# Altium project Enigma Rev B.PrjPCB (part 2 of 8)

## Sheet Snickerdoodle FPGA JB.SchDoc: Snickerdoodle JB
size Tabloid; ApprovedBy: NA; CompanyName: Cospan Design LLC; DrawnBy: Dave McCoy; Engineer: Dave McCoy; DocumentNumber: 5; Revision: A; SheetNumber: 5; SheetTotal: 20; Client: Public; Project: Enigma; ProjectPrettyName: Enigma
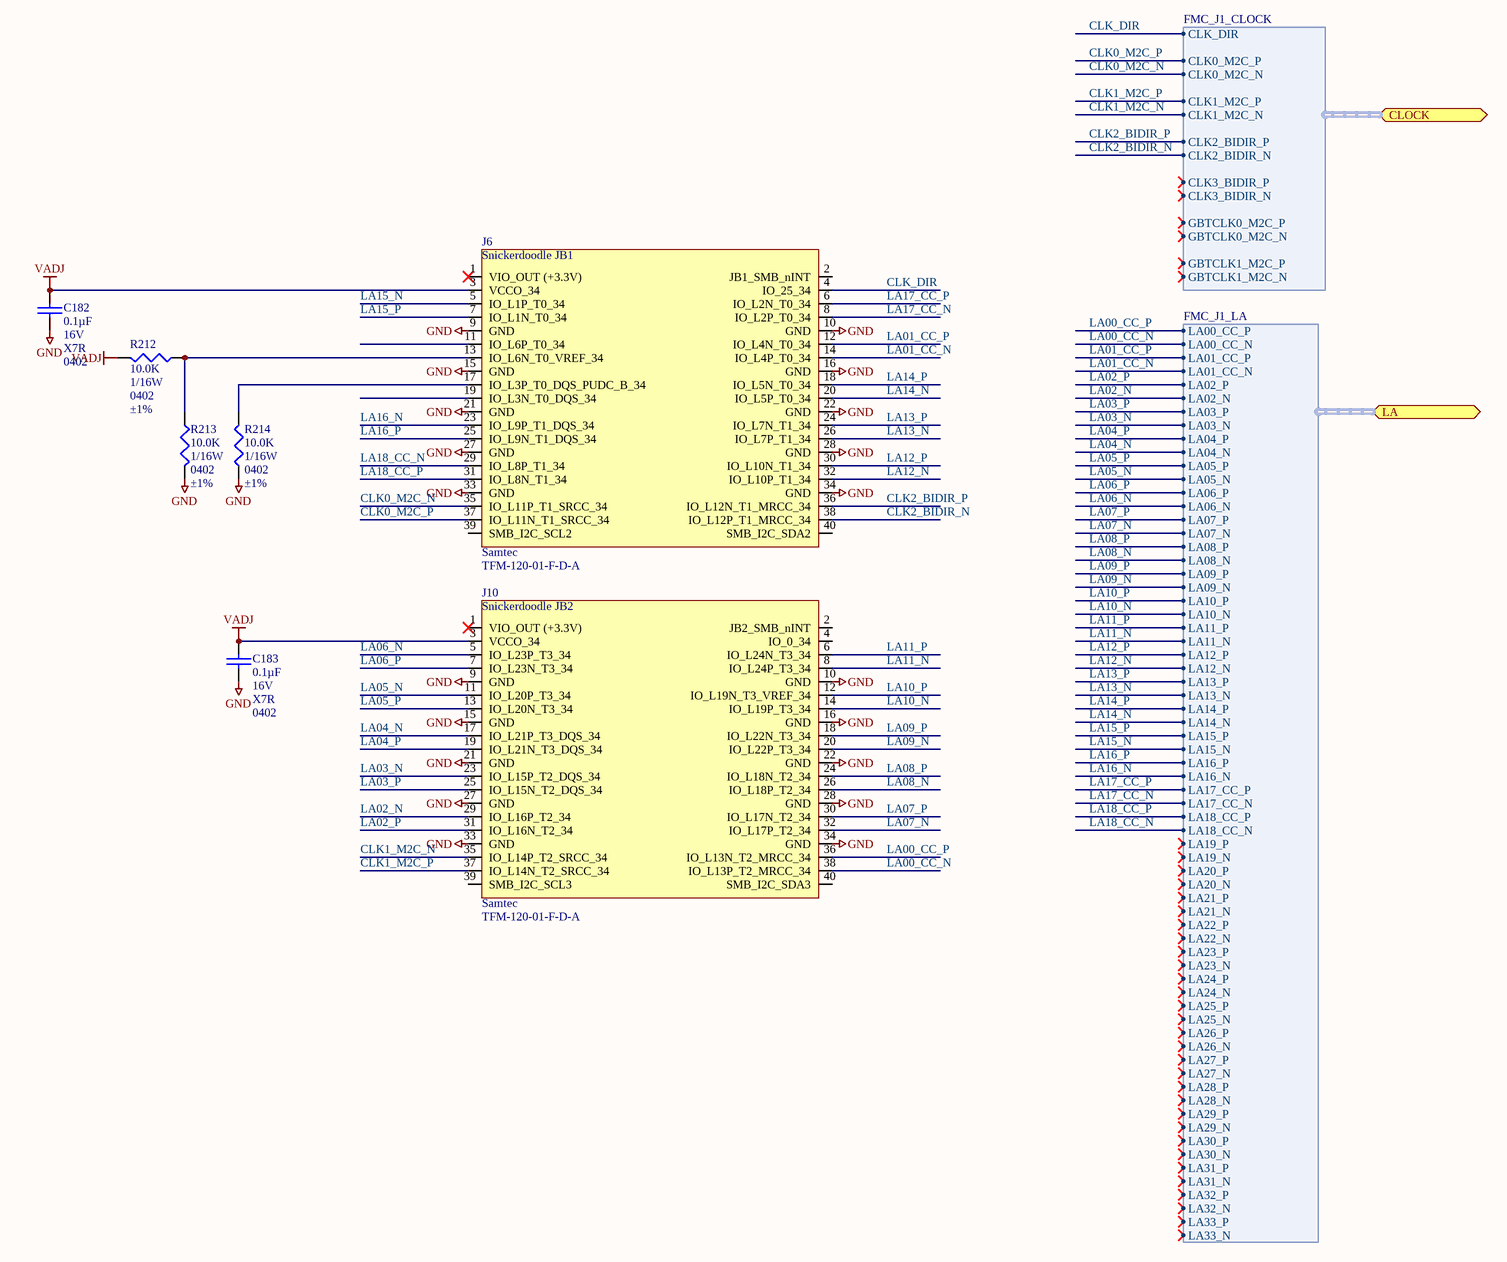
[diagram p5: Snickerdoodle FPGA JB.SchDoc]

### Parts
C182  Capacitance: 0.1µF  Voltage - Rated: 16V  Temperature Coefficient: X7R  Package / Case: 0402  [C_0402]  (hidden comment: 0.1uF)
C183  Capacitance: 0.1µF  Voltage - Rated: 16V  Temperature Coefficient: X7R  Package / Case: 0402  [C_0402]  (hidden comment: 0.1uF)
J6  Manufcaturer: Samtec  Manufacturer Part Number: TFM-120-01-F-D-A  [TFM12001-X-D-A]  (hidden comment: J_SNICKERDOODLE_JB1)
J10  Manufacturer: Samtec  Manufacturer Part Number: TFM-120-01-F-D-A  [TFM12001-X-D-A]  (hidden comment: J_SNICKERDOODLE_JB2)
R212  Resistance In Ohms: 10.0K  Power (Watts): 1/16W  Case: 0402  Tolerance: ±1%  [R_0402]  (hidden comment: R_0402_10.0K)
R213  Resistance In Ohms: 10.0K  Power (Watts): 1/16W  Case: 0402  Tolerance: ±1%  [R_0402]  (hidden comment: R_0402_10.0K)
R214  Resistance In Ohms: 10.0K  Power (Watts): 1/16W  Case: 0402  Tolerance: ±1%  [R_0402]  (hidden comment: R_0402_10.0K)

### Ports
CLOCK (harness FMC_J1_CLOCK), LA (harness FMC_J1_LA)

### Harnesses
FMC_J1_CLOCK: CLK_DIR, CLK0_M2C_N, CLK0_M2C_P, CLK1_M2C_N, CLK1_M2C_P, CLK2_BIDIR_N, CLK2_BIDIR_P, CLK3_BIDIR_N, CLK3_BIDIR_P, GBTCLK0_M2C_N, GBTCLK0_M2C_P, GBTCLK1_M2C_N, GBTCLK1_M2C_P
FMC_J1_LA: LA00_CC_N, LA00_CC_P, LA01_CC_N, LA01_CC_P, LA02_N, LA02_P, LA03_N, LA03_P, LA04_N, LA04_P, LA05_N, LA05_P, LA06_N, LA06_P, LA07_N, LA07_P, LA08_N, LA08_P, LA09_N, LA09_P, LA10_N, LA10_P, LA11_N, LA11_P, LA12_N, LA12_P, LA13_N, LA13_P, LA14_N, LA14_P, LA15_N, LA15_P, LA16_N, LA16_P, LA17_CC_N, LA17_CC_P, LA18_CC_N, LA18_CC_P, LA19_N, LA19_P, LA20_N, LA20_P, LA21_N, LA21_P, LA22_N, LA22_P, LA23_N, LA23_P, LA24_N, LA24_P, LA25_N, LA25_P, LA26_N, LA26_P, LA27_N, LA27_P, LA28_N, LA28_P, LA29_N, LA29_P, LA30_N, LA30_P, LA31_N, LA31_P, LA32_N, LA32_P, LA33_N, LA33_P

### Nets
GND: C182.1 C183.1 J6.9(GND) J6.10(GND) J6.15(GND) J6.16(GND) J6.21(GND) J6.22(GND) J6.27(GND) J6.28(GND) J6.33(GND) J6.34(GND) J10.9(GND) J10.10(GND) J10.15(GND) J10.16(GND) J10.21(GND) J10.22(GND) J10.27(GND) J10.28(GND) J10.33(GND) J10.34(GND) R213.1 R214.2
VADJ: C182.2 C183.2 J6.3(VCCO_34) J10.3(VCCO_34) R212.1
CLK0_M2C_N: J6.35(IO_L11P_T1_SRCC_34) ; port CLOCK.CLK0_M2C_N
CLK0_M2C_P: J6.37(IO_L11N_T1_SRCC_34) ; port CLOCK.CLK0_M2C_P
CLK1_M2C_N: J10.35(IO_L14P_T2_SRCC_34) ; port CLOCK.CLK1_M2C_N
CLK1_M2C_P: J10.37(IO_L14N_T2_SRCC_34) ; port CLOCK.CLK1_M2C_P
CLK2_BIDIR_N: J6.38(IO_L12P_T1_MRCC_34) ; port CLOCK.CLK2_BIDIR_N
CLK2_BIDIR_P: J6.36(IO_L12N_T1_MRCC_34) ; port CLOCK.CLK2_BIDIR_P
CLK_DIR: J6.4(IO_25_34) ; port CLOCK.CLK_DIR
LA00_CC_N: J10.38(IO_L13P_T2_MRCC_34) ; port LA.LA00_CC_N
LA00_CC_P: J10.36(IO_L13N_T2_MRCC_34) ; port LA.LA00_CC_P
LA01_CC_N: J6.14(IO_L4P_T0_34) ; port LA.LA01_CC_N
LA01_CC_P: J6.12(IO_L4N_T0_34) ; port LA.LA01_CC_P
LA02_N: J10.29(IO_L16P_T2_34) ; port LA.LA02_N
LA02_P: J10.31(IO_L16N_T2_34) ; port LA.LA02_P
LA03_N: J10.23(IO_L15P_T2_DQS_34) ; port LA.LA03_N
LA03_P: J10.25(IO_L15N_T2_DQS_34) ; port LA.LA03_P
LA04_N: J10.17(IO_L21P_T3_DQS_34) ; port LA.LA04_N
LA04_P: J10.19(IO_L21N_T3_DQS_34) ; port LA.LA04_P
LA05_N: J10.11(IO_L20P_T3_34) ; port LA.LA05_N
LA05_P: J10.13(IO_L20N_T3_34) ; port LA.LA05_P
LA06_N: J10.5(IO_L23P_T3_34) ; port LA.LA06_N
LA06_P: J10.7(IO_L23N_T3_34) ; port LA.LA06_P
LA07_N: J10.32(IO_L17P_T2_34) ; port LA.LA07_N
LA07_P: J10.30(IO_L17N_T2_34) ; port LA.LA07_P
LA08_N: J10.26(IO_L18P_T2_34) ; port LA.LA08_N
LA08_P: J10.24(IO_L18N_T2_34) ; port LA.LA08_P
LA09_N: J10.20(IO_L22P_T3_34) ; port LA.LA09_N
LA09_P: J10.18(IO_L22N_T3_34) ; port LA.LA09_P
LA10_N: J10.14(IO_L19P_T3_34) ; port LA.LA10_N
LA10_P: J10.12(IO_L19N_T3_VREF_34) ; port LA.LA10_P
LA11_N: J10.8(IO_L24P_T3_34) ; port LA.LA11_N
LA11_P: J10.6(IO_L24N_T3_34) ; port LA.LA11_P
LA12_N: J6.32(IO_L10P_T1_34) ; port LA.LA12_N
LA12_P: J6.30(IO_L10N_T1_34) ; port LA.LA12_P
LA13_N: J6.26(IO_L7P_T1_34) ; port LA.LA13_N
LA13_P: J6.24(IO_L7N_T1_34) ; port LA.LA13_P
LA14_N: J6.20(IO_L5P_T0_34) ; port LA.LA14_N
LA14_P: J6.18(IO_L5N_T0_34) ; port LA.LA14_P
LA15_N: J6.5(IO_L1P_T0_34) ; port LA.LA15_N
LA15_P: J6.7(IO_L1N_T0_34) ; port LA.LA15_P
LA16_N: J6.23(IO_L9P_T1_DQS_34) ; port LA.LA16_N
LA16_P: J6.25(IO_L9N_T1_DQS_34) ; port LA.LA16_P
LA17_CC_N: J6.8(IO_L2P_T0_34) ; port LA.LA17_CC_N
LA17_CC_P: J6.6(IO_L2N_T0_34) ; port LA.LA17_CC_P
LA18_CC_N: J6.29(IO_L8P_T1_34) ; port LA.LA18_CC_N
LA18_CC_P: J6.31(IO_L8N_T1_34) ; port LA.LA18_CC_P
NetJ6_13: J6.13(IO_L6N_T0_VREF_34) R212.2 R213.2
NetJ6_17: J6.17(IO_L3P_T0_DQS_PUDC_B_34) R214.1

Not connected (* = marked no-connect by the designer): J6 1(VIO_OUT_(+3.3V))* 2(JB1_SMB_nINT) 11(IO_L6P_T0_34) 19(IO_L3N_T0_DQS_34) 39(SMB_I2C_SCL2) 40(SMB_I2C_SDA2); J10 1(VIO_OUT_(+3.3V))* 2(JB2_SMB_nINT) 4(IO_0_34) 39(SMB_I2C_SCL3) 40(SMB_I2C_SDA3)

### Notes on the sheet
- Project:
- http://www.cospandesign.com
- Cospan Design
- Document:
- Engineer:
- Title:
- Client:
- Approved By:
- Revision:
- Date:
- Number:
- of
- (in symbol J_SNICKERDOODLE_JB1) Snickerdoodle JB1
- (in symbol J_SNICKERDOODLE_JB2) Snickerdoodle JB2

### Library data of the parts
C182 C183 = C_0402_0.1UF_16V: CAP CER .10UF 16V X7R 0402; Manufacturer: Murata Electronics North America; Manufacturer Part Number: GRM155R71C104KA88J; Tolerance: ±10%; Description: CAP CER 0.1UF 16V X7R 0402; Supplier 1: Digi-Key; RoHS: RoHS Compliant; Category: Capacitors; Stock 1: 18103134; Pricing 1: 1=0.1, 10=0.014, 100=0.0062, 500=0.00442, 1000=0.00348, 2500=0.00316, 5000=0.00291 (USD); Packaging: Cut Tape (CT); Part Status: Active; Operating Temperature: -55°C ~ 125°C; Features: -; Ratings: -; Applications: General Purpose; Mounting Type: Surface Mount, MLCC; Size / Dimension: 0.039" L x 0.020" W (1.00mm x 0.50mm); Height - Seated (Max): -; Thickness (Max): 0.022" (0.55mm); Lead Spacing: -; ComponentLink1URL: http://www.murata.com/~/media/webrenewal/support/library/catalog/products/capacitor/mlcc/c02e.ashx?la=en-us; ComponentLink1Description: http://www.murata.com/~/media/webrenewal/support/library/catalog/products/capacitor/mlcc/c02e.ashx?la=en-us; Supplier Part Number 1: 490-6328-1-ND
J6 = J_SNICKERDOODLE_JB1: SNICKERDOODLE JB1
J10 = J_SNICKERDOODLE_JB2: SNICKERDOODLE JB2
R212-R214 = R_0402_10.0K: RES 10.0K OHM 1/16W 1% 0402 SMD; Manufacturer: Stackpole Electronics Inc; Manufacturer Part Number: RMCF0402FT10K0; Resistance (Ohms): 10k; Temperature Coefficient: ±100ppm/°C; Supplier 1: Digi-Key; Supplier Part Number 1: RMCF0402FT10K0CT-ND; RoHS: RoHS Compliant; Category: Resistors; Stock 1: 234525; Pricing: 1=0.04, 10=0.025, 50=0.0138, 100=0.0105, 250=0.0078, 500=0.00576, 1000=0.00384, 2500=0.00324, 5000=0.0027 (USD); Composition: Thick Film; Features: -; Package / Case: 0402 (1005 Metric); Size / Dimension: 0.039" L x 0.020" W (1.00mm x 0.50mm); Height: 0.016" (0.40mm); Number of Terminations: 2; Packaging: Cut Tape (CT); ComponentLink1URL: http://www.seielect.com/Catalog/SEI-RMCF_RMCP.pdf; ComponentLink1Description: http://www.seielect.com/Catalog/SEI-RMCF_RMCP.pdf

## Sheet LCD.SchDoc: LCD
size Tabloid; ApprovedBy: NA; CompanyName: Cospan Design LLC; DrawnBy: Dave McCoy; Engineer: Dave McCoy; DocumentNumber: 12; Revision: A; SheetNumber: 12; SheetTotal: 20; Client: Public; Project: Enigma; ProjectPrettyName: Enigma
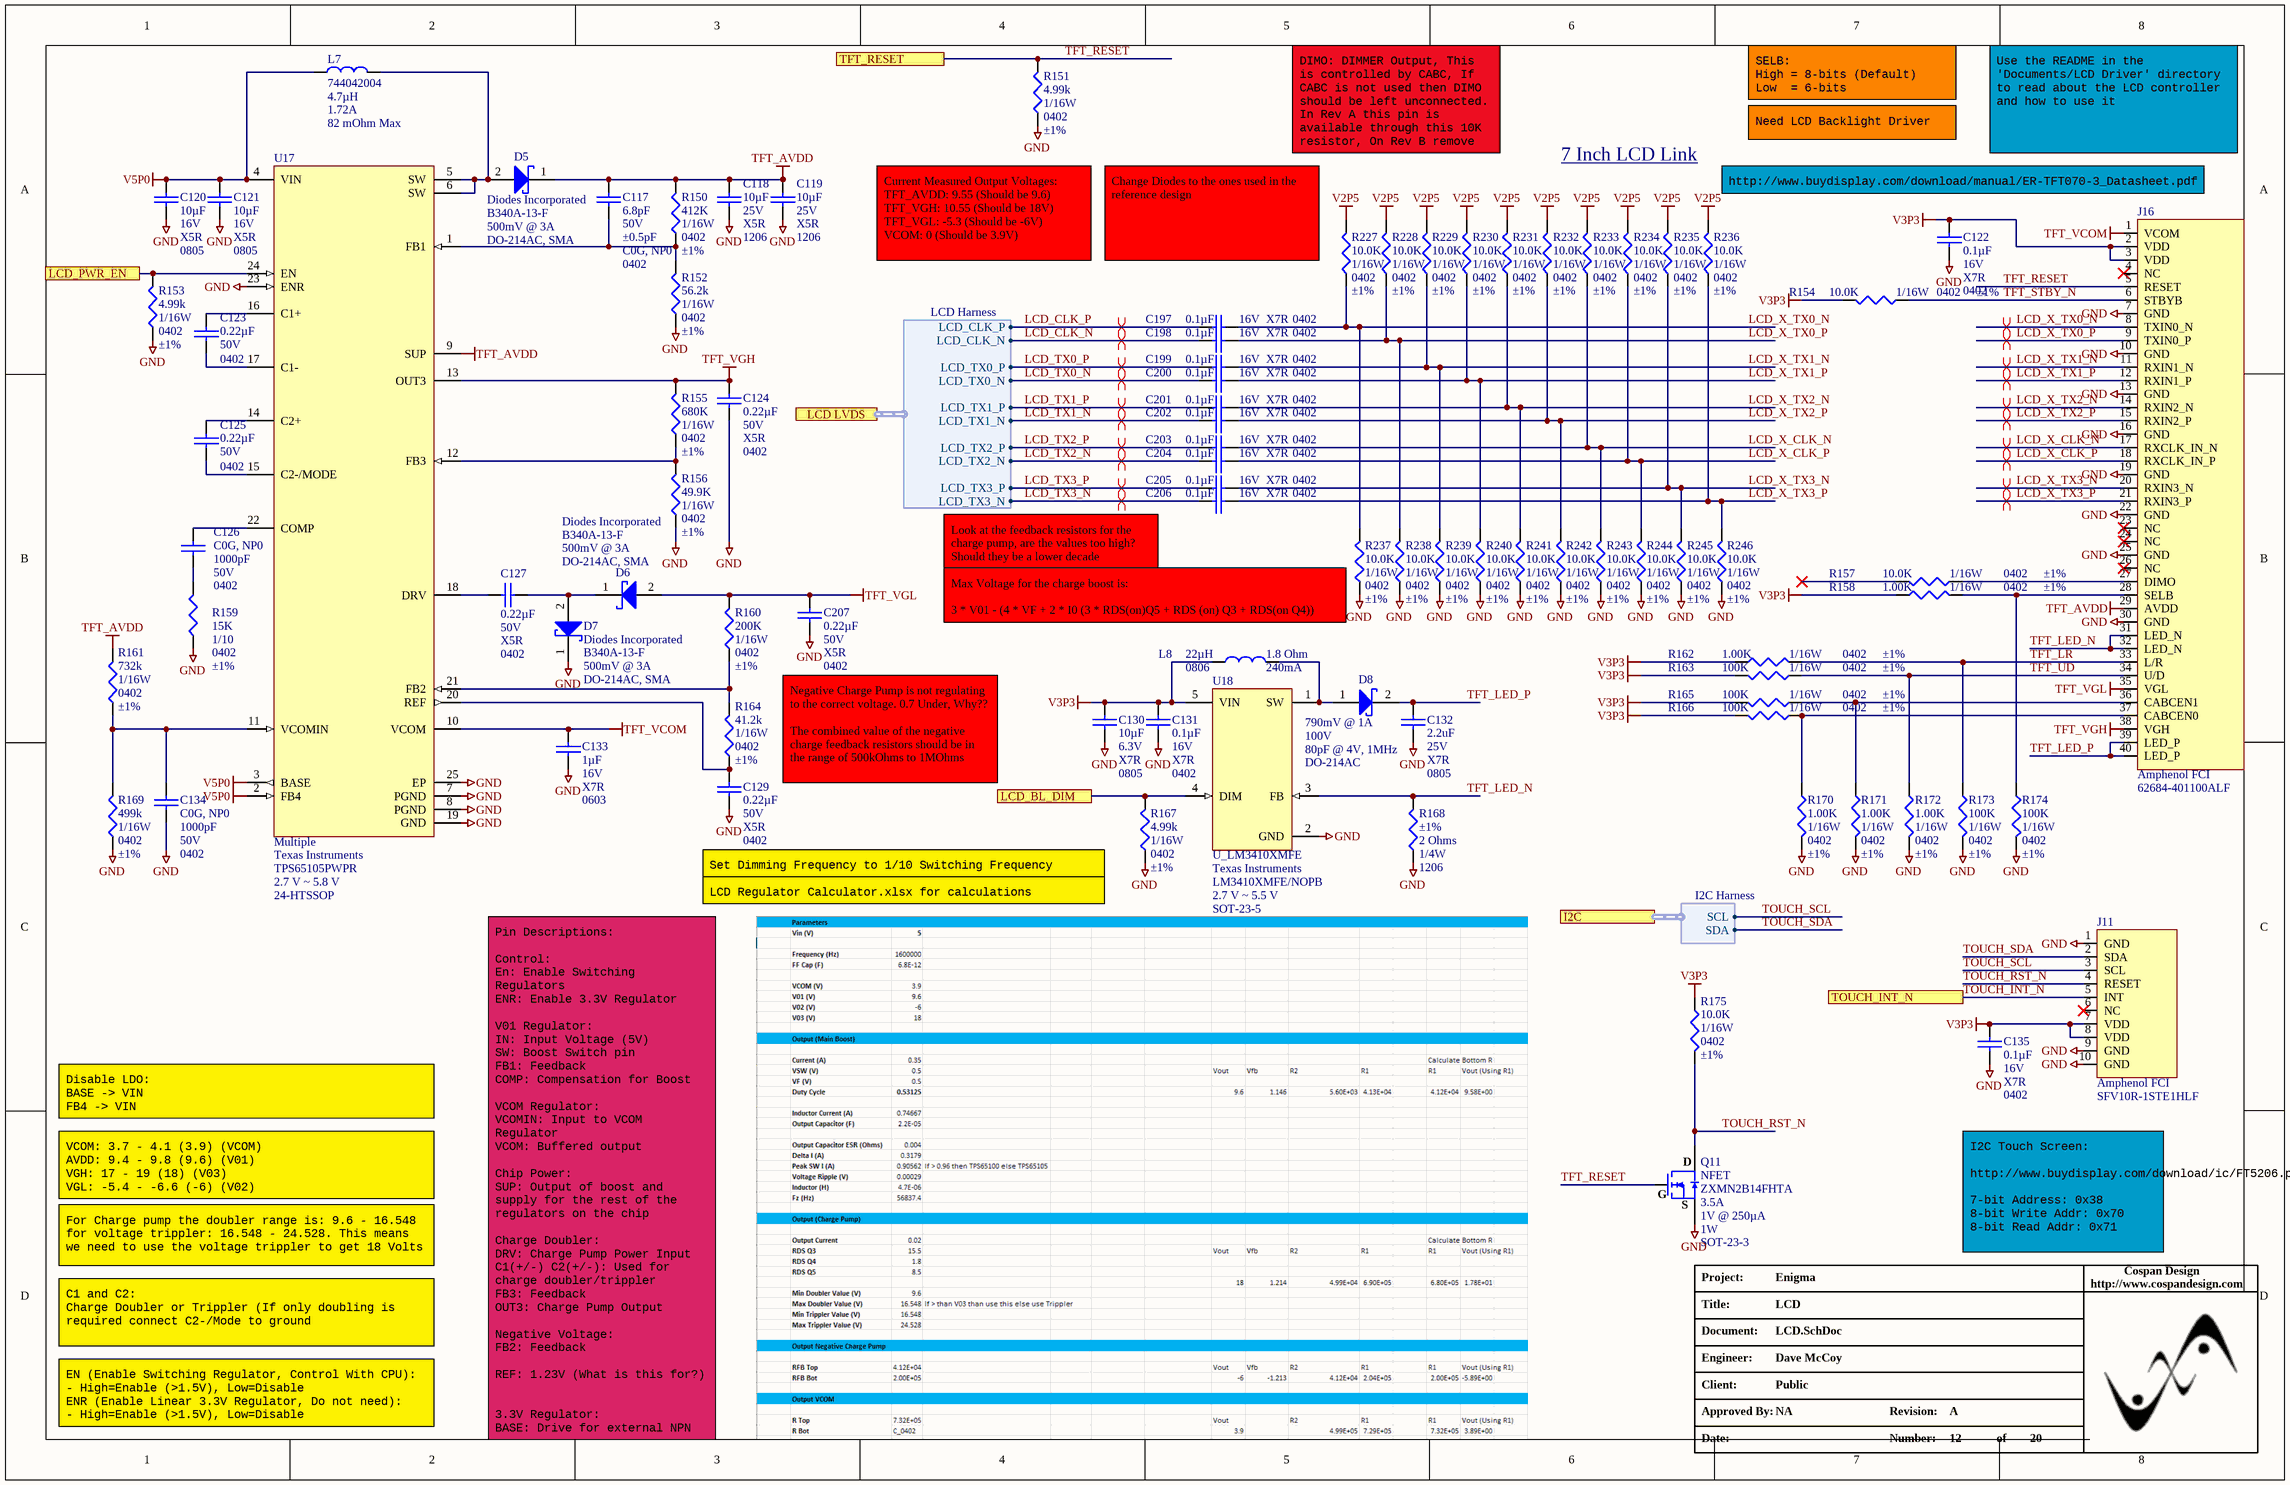
[diagram p6: LCD.SchDoc]

### Parts
C117  Voltage - Rated: 50V  Tolerance: ±0.5pF  Temperature Coefficient: C0G, NP0  Package / Case: 0402  [C_ERA-0402]  (hidden comment: 6.8pF)
C118  Voltage - Rated: 25V  Temperature Coefficient: X5R  Package / Case: 1206  [CAP-1206]  (hidden comment: 10µF)
C119  Voltage - Rated: 25V  Temperature Coefficient: X5R  Package / Case: 1206  [CAP-1206]  (hidden comment: 10µF)
C120  Voltage - Rated: 16V  Temperature Coefficient: X5R  Package / Case: 0805  [C_ERA-0805]  (hidden comment: 10µF)
C121  Voltage - Rated: 16V  Temperature Coefficient: X5R  Package / Case: 0805  [C_ERA-0805]  (hidden comment: 10µF)
C122  Capacitance: 0.1µF  Voltage - Rated: 16V  Temperature Coefficient: X7R  Package / Case: 0402  [C_0402]  (hidden comment: 0.1uF)
C123  Capacitance: 0.22µF  Voltage - Rated: 50V  Package / Case: 0402  [C_ERA-0402]  (hidden comment: C_0402_0.22UF_50V)
C124  Capacitance: 0.22µF  Voltage - Rated: 50V  Temperature Coefficient: X5R  Package / Case: 0402  [C_ERA-0402]  (hidden comment: C_0402_0.22UF_50V)
C125  Capacitance: 0.22µF  Voltage - Rated: 50V  Package / Case: 0402  [C_ERA-0402]  (hidden comment: C_0402_0.22UF_50V)
C126  Temperature Coefficient: C0G, NP0  Voltage - Rated: 50V  Package / Case: 0402  [C_ERA-0402]  (hidden comment: 1000pF)
C127  Capacitance: 0.22µF  Voltage - Rated: 50V  Temperature Coefficient: X5R  Package / Case: 0402  [C_ERA-0402]  (hidden comment: C_0402_0.22UF_50V)
C129  Capacitance: 0.22µF  Voltage - Rated: 50V  Temperature Coefficient: X5R  Package / Case: 0402  [C_ERA-0402]  (hidden comment: C_0402_0.22UF_50V)
C130  Capacitance: 10µF  Voltage - Rated: 6.3V  Temperature Coefficient: X7R  Package / Case: 0805  [C_ERA-0805]  (hidden comment: 10uF)
C131  Capacitance: 0.1µF  Voltage - Rated: 16V  Temperature Coefficient: X7R  Package / Case: 0402  [C_0402]  (hidden comment: 0.1uF)
C132  Capacitance: 2.2uF  Voltage - Rated: 25V  Temperature Coefficient: X7R  Package / Case: 0805  [C_ERA-0805]  (hidden comment: C_0805_2.2uF_25V)
C133  Capacitance: 1µF  Voltage - Rated: 16V  Temperature Coefficient: X7R  Package / Case: 0603  [C_ERA-0603]  (hidden comment: C_0603_1µF_16V)
C134  Temperature Coefficient: C0G, NP0  Voltage - Rated: 50V  Package / Case: 0402  [C_ERA-0402]  (hidden comment: 1000pF)
C135  Capacitance: 0.1µF  Voltage - Rated: 16V  Temperature Coefficient: X7R  Package / Case: 0402  [C_0402]  (hidden comment: 0.1uF)
C197  Capacitance: 0.1µF  Voltage - Rated: 16V  Temperature Coefficient: X7R  Package / Case: 0402  [C_0402]  (hidden comment: 0.1uF)
C198  Capacitance: 0.1µF  Voltage - Rated: 16V  Temperature Coefficient: X7R  Package / Case: 0402  [C_0402]  (hidden comment: 0.1uF)
C199  Capacitance: 0.1µF  Voltage - Rated: 16V  Temperature Coefficient: X7R  Package / Case: 0402  [C_0402]  (hidden comment: 0.1uF)
C200  Capacitance: 0.1µF  Voltage - Rated: 16V  Temperature Coefficient: X7R  Package / Case: 0402  [C_0402]  (hidden comment: 0.1uF)
C201  Capacitance: 0.1µF  Voltage - Rated: 16V  Temperature Coefficient: X7R  Package / Case: 0402  [C_0402]  (hidden comment: 0.1uF)
C202  Capacitance: 0.1µF  Voltage - Rated: 16V  Temperature Coefficient: X7R  Package / Case: 0402  [C_0402]  (hidden comment: 0.1uF)
C203  Capacitance: 0.1µF  Voltage - Rated: 16V  Temperature Coefficient: X7R  Package / Case: 0402  [C_0402]  (hidden comment: 0.1uF)
C204  Capacitance: 0.1µF  Voltage - Rated: 16V  Temperature Coefficient: X7R  Package / Case: 0402  [C_0402]  (hidden comment: 0.1uF)
C205  Capacitance: 0.1µF  Voltage - Rated: 16V  Temperature Coefficient: X7R  Package / Case: 0402  [C_0402]  (hidden comment: 0.1uF)
C206  Capacitance: 0.1µF  Voltage - Rated: 16V  Temperature Coefficient: X7R  Package / Case: 0402  [C_0402]  (hidden comment: 0.1uF)
C207  Capacitance: 0.22µF  Voltage - Rated: 50V  Temperature Coefficient: X5R  Package / Case: 0402  [C_ERA-0402]  (hidden comment: C_0402_0.22UF_50V)
D5  Manufacturer: Diodes Incorporated  Manufacturer Part Number: B340A-13-F  Voltage - Forward (Vf) (Max) @ If: 500mV @ 3A  Package / Case: DO-214AC, SMA  [SMA]  (hidden comment: D_B340A-13-F)
D6  Manufacturer: Diodes Incorporated  Manufacturer Part Number: B340A-13-F  Voltage - Forward (Vf) (Max) @ If: 500mV @ 3A  Package / Case: DO-214AC, SMA  [SMA]  (hidden comment: D_B340A-13-F)
D7  Manufacturer: Diodes Incorporated  Manufacturer Part Number: B340A-13-F  Voltage - Forward (Vf) (Max) @ If: 500mV @ 3A  Package / Case: DO-214AC, SMA  [SMA]  (hidden comment: D_B340A-13-F)
D8  Voltage - Forward (Vf) (Max) @ If: 790mV @ 1A  Voltage - DC Reverse (Vr) (Max): 100V  Capacitance @ Vr, F: 80pF @ 4V, 1MHz  Package / Case: DO-214AC  [DIOM5226X23L]  (hidden comment: B1100-13-F)
J11  Manufacturer: Amphenol FCI  Manufacturer Part Number: SFV10R-1STE1HLF  [ER-CON10HT-1_BTM]  (hidden comment: J_FFC_CONN_RA_10PIN)
J16  Manufacturer: Amphenol FCI  Manufacturer Part Number: 62684-401100ALF  [ER-CON40HT-1_BTM]  (hidden comment: J_FFC_CONN_RA_40PIN)
L7  Manufacturer Part Number: 744042004  Inductance: 4.7µH  Current: 1.72A  DC Resistance (DCR): 82 mOhm Max  [INDP744042006]  (hidden comment: 4.7uH)
L8  Current: 240mA  Package / Case: 0806  Inductance: 22µH  DC Resistance (DCR): 1.8 Ohm  [L_0806]  (hidden comment: CBC2016T220K)
Q11  NFET  Manufacturer Part Number: ZXMN2B14FHTA  Current - Continuous Drain (Id) @ 25° C: 3.5A  Vgs(th) (Max) @ Id: 1V @ 250µA  Power - Max: 1W  Package / Case: SOT-23-3  [SOT-23A]
R150  Resistance In Ohms: 412K  Power (Watts): 1/16W  Case: 0402  Tolerance: ±1%  [R_0402]  (hidden comment: R_0402_412K)
R151  Power (Watts): 1/16W  Case: 0402  Tolerance: ±1%  [R_0402]  (hidden comment: 4.99k)
R152  Power (Watts): 1/16W  Case: 0402  Tolerance: ±1%  [R_0402]  (hidden comment: 56.2k)
R153  Power (Watts): 1/16W  Case: 0402  Tolerance: ±1%  [R_0402]  (hidden comment: 4.99k)
R154  Resistance In Ohms: 10.0K  Power (Watts): 1/16W  Case: 0402  Tolerance: ±1%  [R_0402]  (hidden comment: R_0402_10.0K)
R155  Resistance In Ohms: 680K  Power (Watts): 1/16W  Case: 0402  Tolerance: ±1%  [R_0402]  (hidden comment: R_0402_680K)
R156  Resistance In Ohms: 49.9K  Power (Watts): 1/16W  Case: 0402  Tolerance: ±1%  [R_0402]  (hidden comment: R_0402_49.9K)
R157  Resistance In Ohms: 10.0K  Power (Watts): 1/16W  Case: 0402  Tolerance: ±1%  [R_0402]  (hidden comment: R_0402_10.0K)
R158  Resistance In Ohms: 1.00K  Power (Watts): 1/16W  Case: 0402  Tolerance: ±1%  [R_0402]  (hidden comment: 1.0k Ohms)
R159  Resistance In Ohms: 15K  Power (Watts): 1/10  Case: 0402  Tolerance: ±1%  [R_0402]  (hidden comment: R_0402_15.0K)
R160  Resistance In Ohms: 200K  Power (Watts): 1/16W  Case: 0402  Tolerance: ±1%  [R_0402]  (hidden comment: R_0402_200.0K)
R161  Resistance In Ohms: 732k  Power (Watts): 1/16W  Case: 0402  Tolerance: ±1%  [R_0402]  (hidden comment: R_0402_732k)
R162  Resistance In Ohms: 1.00K  Power (Watts): 1/16W  Case: 0402  Tolerance: ±1%  [R_0402]  (hidden comment: 1.0k Ohms)
R163  Resistance In Ohms: 100K  Power (Watts): 1/16W  Case: 0402  Tolerance: ±1%  [R_0402]  (hidden comment: R_0402_100K)
R164  Resistance In Ohms: 41.2k  Power (Watts): 1/16W  Case: 0402  Tolerance: ±1%  [R_0402]  (hidden comment: R_0402_41.2K)
R165  Resistance In Ohms: 100K  Power (Watts): 1/16W  Case: 0402  Tolerance: ±1%  [R_0402]  (hidden comment: R_0402_100K)
R166  Resistance In Ohms: 100K  Power (Watts): 1/16W  Case: 0402  Tolerance: ±1%  [R_0402]  (hidden comment: R_0402_100K)
R167  Power (Watts): 1/16W  Case: 0402  Tolerance: ±1%  [R_0402]  (hidden comment: 4.99k)
R168  Tolerance: ±1%  Resistance In Ohms: 2 Ohms  Power (Watts): 1/4W  Case: 1206  [R_1206]  (hidden comment: R_1206_2)
R169  Resistance In Ohms: 499k  Power (Watts): 1/16W  Case: 0402  Tolerance: ±1%  [R_0402]  (hidden comment: R_0402_499k)
R170  Resistance In Ohms: 1.00K  Power (Watts): 1/16W  Case: 0402  Tolerance: ±1%  [R_0402]  (hidden comment: 1.0k Ohms)
R171  Resistance In Ohms: 1.00K  Power (Watts): 1/16W  Case: 0402  Tolerance: ±1%  [R_0402]  (hidden comment: 1.0k Ohms)
R172  Resistance In Ohms: 1.00K  Power (Watts): 1/16W  Case: 0402  Tolerance: ±1%  [R_0402]  (hidden comment: 1.0k Ohms)
R173  Resistance In Ohms: 100K  Power (Watts): 1/16W  Case: 0402  Tolerance: ±1%  [R_0402]  (hidden comment: R_0402_100K)
R174  Resistance In Ohms: 100K  Power (Watts): 1/16W  Case: 0402  Tolerance: ±1%  [R_0402]  (hidden comment: R_0402_100K)
R175  Resistance In Ohms: 10.0K  Power (Watts): 1/16W  Case: 0402  Tolerance: ±1%  [R_0402]  (hidden comment: R_0402_10.0K)
R227  Resistance In Ohms: 10.0K  Power (Watts): 1/16W  Case: 0402  Tolerance: ±1%  [R_0402]  (hidden comment: R_0402_10.0K)
R228  Resistance In Ohms: 10.0K  Power (Watts): 1/16W  Case: 0402  Tolerance: ±1%  [R_0402]  (hidden comment: R_0402_10.0K)
R229  Resistance In Ohms: 10.0K  Power (Watts): 1/16W  Case: 0402  Tolerance: ±1%  [R_0402]  (hidden comment: R_0402_10.0K)
R230  Resistance In Ohms: 10.0K  Power (Watts): 1/16W  Case: 0402  Tolerance: ±1%  [R_0402]  (hidden comment: R_0402_10.0K)
R231  Resistance In Ohms: 10.0K  Power (Watts): 1/16W  Case: 0402  Tolerance: ±1%  [R_0402]  (hidden comment: R_0402_10.0K)
R232  Resistance In Ohms: 10.0K  Power (Watts): 1/16W  Case: 0402  Tolerance: ±1%  [R_0402]  (hidden comment: R_0402_10.0K)
R233  Resistance In Ohms: 10.0K  Power (Watts): 1/16W  Case: 0402  Tolerance: ±1%  [R_0402]  (hidden comment: R_0402_10.0K)
R234  Resistance In Ohms: 10.0K  Power (Watts): 1/16W  Case: 0402  Tolerance: ±1%  [R_0402]  (hidden comment: R_0402_10.0K)
R235  Resistance In Ohms: 10.0K  Power (Watts): 1/16W  Case: 0402  Tolerance: ±1%  [R_0402]  (hidden comment: R_0402_10.0K)
R236  Resistance In Ohms: 10.0K  Power (Watts): 1/16W  Case: 0402  Tolerance: ±1%  [R_0402]  (hidden comment: R_0402_10.0K)
R237  Resistance In Ohms: 10.0K  Power (Watts): 1/16W  Case: 0402  Tolerance: ±1%  [R_0402]  (hidden comment: R_0402_10.0K)
R238  Resistance In Ohms: 10.0K  Power (Watts): 1/16W  Case: 0402  Tolerance: ±1%  [R_0402]  (hidden comment: R_0402_10.0K)
R239  Resistance In Ohms: 10.0K  Power (Watts): 1/16W  Case: 0402  Tolerance: ±1%  [R_0402]  (hidden comment: R_0402_10.0K)
R240  Resistance In Ohms: 10.0K  Power (Watts): 1/16W  Case: 0402  Tolerance: ±1%  [R_0402]  (hidden comment: R_0402_10.0K)
R241  Resistance In Ohms: 10.0K  Power (Watts): 1/16W  Case: 0402  Tolerance: ±1%  [R_0402]  (hidden comment: R_0402_10.0K)
R242  Resistance In Ohms: 10.0K  Power (Watts): 1/16W  Case: 0402  Tolerance: ±1%  [R_0402]  (hidden comment: R_0402_10.0K)
R243  Resistance In Ohms: 10.0K  Power (Watts): 1/16W  Case: 0402  Tolerance: ±1%  [R_0402]  (hidden comment: R_0402_10.0K)
R244  Resistance In Ohms: 10.0K  Power (Watts): 1/16W  Case: 0402  Tolerance: ±1%  [R_0402]  (hidden comment: R_0402_10.0K)
R245  Resistance In Ohms: 10.0K  Power (Watts): 1/16W  Case: 0402  Tolerance: ±1%  [R_0402]  (hidden comment: R_0402_10.0K)
R246  Resistance In Ohms: 10.0K  Power (Watts): 1/16W  Case: 0402  Tolerance: ±1%  [R_0402]  (hidden comment: R_0402_10.0K)
U17  Voltage - Output: Multiple  Manufacturer: Texas Instruments  Manufacturer Part Number: TPS65105PWPR  Voltage - Input: 2.7 V ~ 5.8 V  Supplier Device Package: 24-HTSSOP  [PWP0024B_L]  (hidden comment: U_TPS65105PWPR)
U18  U_LM3410XMFE  Manufacturer: Texas Instruments  Manufacturer Part Number: LM3410XMFE/NOPB  Voltage - Supply: 2.7 V ~ 5.5 V  Supplier Device Package: SOT-23-5  [MF05A_N]

### Ports
I2C (harness I2C Harness), LCD LVDS (harness LCD Harness), LCD_BL_DIM, LCD_PWR_EN, TFT_RESET, TOUCH_INT_N

### Harnesses
LCD Harness: LCD_CLK_P, LCD_CLK_N, LCD_TX0_P, LCD_TX0_N, LCD_TX1_P, LCD_TX1_N, LCD_TX2_P, LCD_TX2_N, LCD_TX3_P, LCD_TX3_N
I2C Harness: SCL, SDA

### Nets
GND: C118.1 C119.1 C120.1 C121.1 C122.1 C124.2 C129.1 C130.1 C131.1 C132.1 C133.1 C134.1 C135.1 C207.2 D7.1 J11.1(GND) J11.9(GND) J11.10(GND) J16.7(GND) J16.10(GND) J16.13(GND) J16.16(GND) J16.19(GND) J16.22(GND) J16.25(GND) J16.30(GND) Q11.2(S) R151.2 R152.2 R153.2 R156.2 R159.2 R167.2 R168.2 R169.2 R170.1 R171.1 R172.1 R173.1 R174.1 R237.2 R238.2 R239.2 R240.2 R241.2 R242.2 R243.2 R244.2 R245.2 R246.2 U17.7(PGND) U17.8(PGND) U17.19(GND) U17.23(ENR) U17.25(EP) U18.2(GND)
TFT_AVDD: C117.2 C118.2 C119.2 D5.1 J16.29(AVDD) R150.1 R161.1 U17.9(SUP)
TFT_VCOM: C133.2 J16.1(VCOM) U17.10(VCOM)
TFT_VGH: C124.1 J16.38(VGH) R155.1 U17.13(OUT3)
TFT_VGL: C207.1 D6.2 J16.35(VGL) R160.1
V2P5: R227.1 R228.1 R229.1 R230.1 R231.1 R232.1 R233.1 R234.1 R235.1 R236.1
V3P3: C122.2 C130.2 C131.2 C135.2 J11.7(VDD) J11.8(VDD) J16.2(VDD) J16.3(VDD) L8.1 R154.1 R158.2 R162.2 R163.1 R165.1 R166.1 R175.2 U18.5(VIN)
V5P0: C120.2 C121.2 L7.1 U17.2(FB4) U17.3(BASE) U17.4(VIN)
LCD_BL_DIM: R167.1 U18.4(DIM) ; port LCD_BL_DIM
LCD_CLK_N: C198.2 ; port LCD LVDS.LCD_CLK_N
LCD_CLK_P: C197.2 ; port LCD LVDS.LCD_CLK_P
LCD_PWR_EN: R153.1 U17.24(EN) ; port LCD_PWR_EN
LCD_TX0_N: C200.2 ; port LCD LVDS.LCD_TX0_N
LCD_TX0_P: C199.2 ; port LCD LVDS.LCD_TX0_P
LCD_TX1_N: C202.2 ; port LCD LVDS.LCD_TX1_N
LCD_TX1_P: C201.2 ; port LCD LVDS.LCD_TX1_P
LCD_TX2_N: C204.2 ; port LCD LVDS.LCD_TX2_N
LCD_TX2_P: C203.2 ; port LCD LVDS.LCD_TX2_P
LCD_TX3_N: C206.2 ; port LCD LVDS.LCD_TX3_N
LCD_TX3_P: C205.2 ; port LCD LVDS.LCD_TX3_P
LCD_X_CLK_N: C203.1 J16.17(RXCLK_IN_N) R233.2 R243.1
LCD_X_CLK_P: C204.1 J16.18(RXCLK_IN_P) R234.2 R244.1
LCD_X_TX0_N: C197.1 J16.8(TXIN0_N) R227.2 R237.1
LCD_X_TX0_P: C198.1 J16.9(TXIN0_P) R228.2 R238.1
LCD_X_TX1_N: C199.1 J16.11(RXIN1_N) R229.2 R239.1
LCD_X_TX1_P: C200.1 J16.12(RXIN1_P) R230.2 R240.1
LCD_X_TX2_N: C201.1 J16.14(RXIN2_N) R231.2 R241.1
LCD_X_TX2_P: C202.1 J16.15(RXIN2_P) R232.2 R242.1
LCD_X_TX3_N: C205.1 J16.20(RXIN3_N) R235.2 R245.1
LCD_X_TX3_P: C206.1 J16.21(RXIN3_P) R236.2 R246.1
TFT_LED_N: J16.31(LED_N) J16.32(LED_N) R168.1 U18.3(FB)
TFT_LED_P: C132.2 D8.2(K) J16.39(LED_P) J16.40(LED_P)
TFT_LR: J16.33(L/R) R162.1 R173.2
TFT_RESET: J16.5(RESET) Q11.1(G) R151.1 ; port TFT_RESET
TFT_STBY_N: J16.6(STBYB) R154.2
TFT_UD: J16.34(U/D) R163.2 R172.2
TOUCH_INT_N: J11.5(INT) ; port TOUCH_INT_N
TOUCH_RST_N: J11.4(RESET) Q11.3(D) R175.1
TOUCH_SCL: J11.3(SCL) ; port I2C.SCL
TOUCH_SDA: J11.2(SDA) ; port I2C.SDA
NetC117_1: C117.1 R150.2 R152.1 U17.1(FB1)
NetC123_1: C123.1 U17.16(C1+)
NetC123_2: C123.2 U17.17(C1-)
NetC125_1: C125.1 U17.14(C2+)
NetC125_2: C125.2 U17.15(C2-/MODE)
NetC126_1: C126.1 R159.1
NetC126_2: C126.2 U17.22(COMP)
NetC127_1: C127.1 U17.18(DRV)
NetC127_2: C127.2 D6.1 D7.2
NetC129_2: C129.2 R164.2 U17.20(REF)
NetC134_2: C134.2 R161.2 R169.1 U17.11(VCOMIN)
NetD5_2: D5.2 L7.2 U17.5(SW) U17.6(SW)
NetD8_1: D8.1(A) L8.2 U18.1(SW)
NetJ16_27: J16.27(DIMO) R157.2
NetJ16_28: J16.28(SELB) R158.1 R174.2
NetJ16_36: J16.36(CABCEN1) R165.2 R171.2
NetJ16_37: J16.37(CABCEN0) R166.2 R170.2
NetR155_2: R155.2 R156.1 U17.12(FB3)
NetR160_2: R160.2 R164.1 U17.21(FB2)

Not connected (* = marked no-connect by the designer): J11 6(NC)*; J16 4(NC)* 23(NC)* 24(NC)* 26(NC)*; R157 1*

### Layout directives
differential pair: LCD_CLK_N, LCD_CLK_P, LCD_TX0_N, LCD_TX0_P, LCD_TX1_N, LCD_TX1_P, LCD_TX2_N, LCD_TX2_P, LCD_TX3_N, LCD_TX3_P, LCD_X_CLK_N, LCD_X_CLK_P, LCD_X_TX0_N, LCD_X_TX0_P, LCD_X_TX1_N, LCD_X_TX1_P, LCD_X_TX2_N, LCD_X_TX2_P, LCD_X_TX3_N, LCD_X_TX3_P

### Notes on the sheet
- SELB:
  High = 8-bits (Default)
  Low  = 6-bits
- DIMO: DIMMER Output, This is controlled by CABC, If CABC is not used then DIMO should be left unconnected. In Rev A this pin is available through this 10K resistor, On Rev B remove this resistor
- 7 Inch LCD Link <http://www.buydisplay.com/download/manual/ER-TFT070-3_Datasheet.pdf>
- Need LCD Backlight Driver
- Use the README in the 'Documents/LCD Driver' directory to read about the LCD controller and how to use it
- http://www.buydisplay.com/download/manual/ER-TFT070-3_Datasheet.pdf
- Current Measured Output Voltages:
  TFT_AVDD: 9.55 (Should be 9.6)
  TFT_VGH: 10.55 (Should be 18V)
  TFT_VGL: -5.3 (Should be -6V)
  VCOM: 0 (Should be 3.9V)
- (near R227) Change Diodes to the ones used in the reference design
- Look at the feedback resistors for the charge pump, are the values too high? Should they be a lower decade
- (near R237) Max Voltage for the charge boost is:
  3 * V01 - (4 * VF + 2 * I0 (3 * RDS(on)Q5 + RDS (on) Q3 + RDS(on Q4))
  3 * 9.6 - (4 * .5 + 2 * 0.02 (3 * 8.5 + 15.5 + 1.8)) = 25.94
- Negative Charge Pump is not regulating to the correct voltage. 0.7 Under, Why??
  The combined value of the negative charge feedback resistors should be in the range of 500kOhms to 1MOhms
- (near R167) LCD Regulator Calculator.xlsx for calculations
- Set Dimming Frequency to 1/10 Switching Frequency
- Disable LDO:
  BASE -> VIN
  FB4 -> VIN
- VCOM: 3.7 - 4.1 (3.9) (VCOM)
  AVDD: 9.4 - 9.8 (9.6) (V01)
  VGH: 17 - 19 (18) (V03)
  VGL: -5.4 - -6.6 (-6) (V02)
- For Charge pump the doubler range is: 9.6 - 16.548 for voltage trippler: 16.548 - 24.528. This means we need to use the voltage trippler to get 18 Volts
- I2C Touch Screen:
  http://www.buydisplay.com/download/ic/FT5206.pdf
  7-bit Address: 0x38
  8-bit Write Addr: 0x70
  8-bit Read Addr: 0x71
- C1 and C2:
  Charge Doubler or Trippler (If only doubling is required connect C2-/Mode to ground
- EN (Enable Switching Regulator, Control With CPU):
  - High=Enable (>1.5V), Low=Disable
  ENR (Enable Linear 3.3V Regulator, Do not need):
  - High=Enable (>1.5V), Low=Disable
- Pin Descriptions:
  Control:
  En: Enable Switching Regulators
  ENR: Enable 3.3V Regulator
  V01 Regulator:
  IN: Input Voltage (5V)
  SW: Boost Switch pin
  FB1: Feedback
  COMP: Compensation for Boost
  VCOM Regulator:
  VCOMIN: Input to VCOM Regulator
  VCOM: Buffered output
  Chip Power:
  SUP: Output of boost and supply for the rest of the regulators on the chip
  Charge Doubler:
  DRV: Charge Pump Power Input
  C1(+/-) C2(+/-): Used for charge doubler/trippler
  FB3: Feedback
  OUT3: Charge Pump Output
  Negative Voltage:
  FB2: Feedback
  REF: 1.23V (What is this for?)
  3.3V Regulator:
  BASE: Drive for external NPN (used for 3.3V Regulator)
  FB4: Feedback for 3.3V Regulator
- Project:
- http://www.cospandesign.com
- Cospan Design
- Document:
- Engineer:
- Title:
- Client:
- Approved By:
- Revision:
- Date:
- Number:
- of